# Altium schematic sheet karmanDB_sensors1.SchDoc
size A
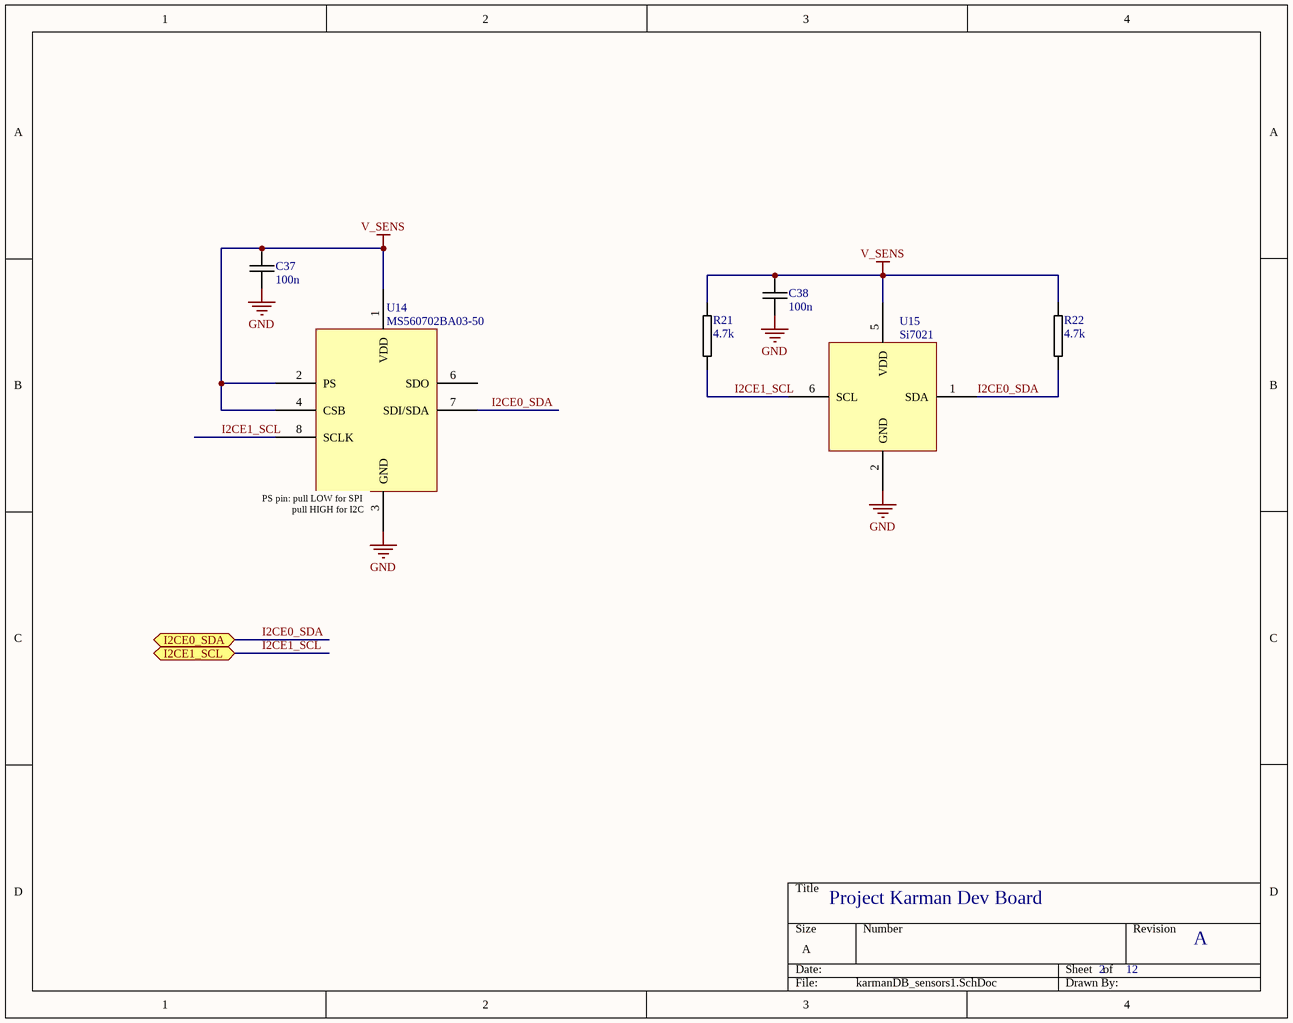
[diagram p0: karmanDB_sensors1.SchDoc]

## Parts
C37  100n  [MURATA_GRM_0603]
C38  100n  [MURATA_GRM_0603]
R21  4.7k  [PANASONIC_ERJ2R_SERIES]
R22  4.7k  [PANASONIC_ERJ2R_SERIES]
U14  MS560702BA03-50  [8 MS560702BA03-50]
U15  Si7021  [7 Si7021-A20]

## Ports
I2CE0_SDA (bidir), I2CE1_SCL (bidir)

## Nets
GND: C37.2 C38.2 U14.3(GND) U15.2(GND)
V_SENS: C37.1 C38.1 R21.1 R22.1 U14.1(VDD) U14.2(PS) U14.4(CSB) U15.5(VDD)
I2CE0_SDA: R22.2 U14.7(SDI/SDA) U15.1(SDA) ; port I2CE0_SDA
I2CE1_SCL: R21.2 U14.8(SCLK) U15.6(SCL) ; port I2CE1_SCL

Not connected (* = marked no-connect by the designer): U14 6(SDO); U15 3(DNC) 4(DNC)

## Notes on the sheet
- (near U14) PS pin: pull LOW for SPI
  pull HIGH for I2C
- Project Karman Dev Board
- 2
- 12
- A

## Library data of the parts
C37 C38 = CAP_MURATA_GRM188R71C104KA01D: CAP CER 0.1UF 16V 10% X7R 0603; Manufacturer: Murata Electronics North America; Capacitance: 0.1µF; Supplier 1: Digi-Key; Supplier Part Number 1: 490-1532-1-ND; Manufacturer Part Number: GRM188R71C104KA01D; RoHS: RoHS Compliant; Category: Capacitors; Stock 1: 2486193; Pricing: 1=0.1, 10=0.019, 50=0.0102, 100=0.0086, 250=0.00704, 500=0.006, 1000=0.00468 (USD); Packaging: Cut Tape (CT); Tolerance: ±10%; Voltage - Rated: 16V; Temperature Coefficient: X7R; Mounting Type: Surface Mount, MLCC; Operating Temperature: -55°C ~ 125°C; Applications: General Purpose; Ratings: -; Package / Case: 0603 (1608 Metric); Size / Dimension: 0.063" L x 0.031" W (1.60mm x 0.80mm); Height - Seated (Max): -; Thickness (Max): 0.035" (0.90mm); Lead Spacing: -; Features: -; Lead Style: -; ComponentLink1URL: http://www.murata.com/~/media/webrenewal/support/library/catalog/products/capacitor/mlcc/c02e.ashx; ComponentLink1Description: http://www.murata.com/~/media/webrenewal/support/library/catalog/products/capacitor/mlcc/c02e.ashx
R21 R22 = RES_PANASONIC_ERJ-2RKF4701X: RES SMD 4.7K OHM 1% 1/10W 0402; Manufacturer: Panasonic Electronic Components; Power (Watts): 0.1W, 1/10W; Temperature Coefficient: ±100ppm/°C; Supplier 1: Digi-Key; Manufacturer Part Number: ERJ-2RKF4701X; RoHS: RoHS Compliant; Category: Resistors; Stock 1: 2910000; Pricing 1: 10000=0.00281, 30000=0.00247, 50000=0.00226, 100000=0.00222 (USD); Packaging: Tape & Reel (TR); Resistance (Ohms): 4.7k; Tolerance: ±1%; Composition: Thick Film; Features: Automotive AEC-Q200; Operating Temperature: -55°C ~ 155°C; Package / Case: 0402 (1005 Metric); Supplier Device Package: 0402; Size / Dimension: 0.039" L x 0.020" W (1.00mm x 0.50mm); Height: 0.016" (0.40mm); Number of Terminations: 2; ComponentLink1URL: http://industrial.panasonic.com/www-cgi/jvcr13pz.cgi?E+PZ+3+AOA0002+ERJ2RKF4701X+7+WW; ComponentLink1Description: http://industrial.panasonic.com/www-cgi/jvcr13pz.cgi?E+PZ+3+AOA0002+ERJ2RKF4701X+7+WW; Supplier Part Number 1: P4.70KLTR-ND
U14 = MS560702BA03-50: BAROMETRIC PRESSURE SENSOR; Manufacturer: TE Connectivity Measurement Specialties; Pressure Type: Absolute; Operating Pressure: 0.15 PSI ~ 17.4 PSI (1 kPa ~ 120 kPa); Output Type: I²C, SPI; Output: 24 b; Accuracy: ±0.022 PSI (±0.15 kPa); Voltage - Supply: 1.8 V ~ 3.6 V; Port Style: No Port; Maximum Pressure: 87.02 PSI (600 kPa); Supplier 1: Digi-Key; Manufacturer Part Number: MS560702BA03-50; RoHS: RoHS Compliant; Category: Sensors, Transducers; Stock 1: 9112; Pricing 1: 1=5.98, 10=4.664, 25=3.784, 50=3.344, 100=3.256, 250=2.992, 500=2.728, 750=2.64, 1000=2.552 (USD); Port Size: -; Features: -; Termination Style: *; Operating Temperature: -40°C ~ 85°C; Package / Case: *; Supplier Device Package: *; ComponentLink1URL: http://www.meas-spec.com/downloads/MS5607-02BA03.pdf; ComponentLink1Description: http://www.meas-spec.com/downloads/MS5607-02BA03.pdf; Supplier Part Number 1: 223-1198-1-ND
U15 = SI7021-A20-GM: IC TEMP SENSOR RH 3% 6DFN; Manufacturer: Silicon Labs; Sensor Type: Humidity, Temperature; Humidity Range: 0 ~ 100% RH; Output Type: I²C; Output: 12b; Accuracy: ±3% RH; Response Time: 18S; Voltage - Supply: 1.9 V ~ 3.6 V; Supplier 1: Digi-Key; Manufacturer Part Number: SI7021-A20-GM; RoHS: RoHS Compliant; Category: Sensors, Transducers; Stock 1: 755; Pricing 1: 1=3.87, 25=3.5496, 100=3.227, 1000=2.90426 (USD); Sensitivity: -; Mounting Type: Surface Mount; Operating Temperature: -40°C ~ 85°C; ComponentLink1URL: https://www.silabs.com/Support%20Documents/TechnicalDocs/Si7021-A20.pdf; ComponentLink1Description: https://www.silabs.com/Support%20Documents/TechnicalDocs/Si7021-A20.pdf; Supplier Part Number 1: 336-3140-5-ND